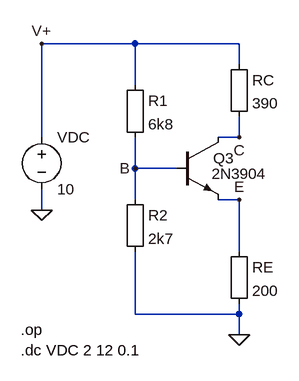
[diagram p0: schematic Transistorarbeitspunkt_Analyse.asc]
Transistorarbeitspunkt_Analyse.asc, the LTspice schematic file:
Version 4
SHEET 1 1160 680
WIRE -736 -160 -880 -160
WIRE -576 -160 -736 -160
WIRE -576 -128 -576 -160
WIRE -736 -96 -736 -160
WIRE -880 -16 -880 -160
WIRE -576 -16 -576 -48
WIRE -576 -16 -608 -16
WIRE -736 32 -736 -16
WIRE -672 32 -736 32
WIRE -736 80 -736 32
WIRE -576 80 -608 80
WIRE -880 96 -880 64
WIRE -576 160 -576 80
WIRE -736 256 -736 160
WIRE -576 256 -576 240
WIRE -576 256 -736 256
WIRE -576 288 -576 256
FLAG -880 96 0
FLAG -576 288 0
FLAG -880 -160 V+
FLAG -736 32 B
FLAG -576 -16 C
FLAG -576 80 E
SYMBOL EuropeanResistor -592 144 R0
SYMATTR InstName RE
SYMATTR Value 200
SYMBOL EuropeanResistor -592 -144 R0
SYMATTR InstName RC
SYMATTR Value 390
SYMBOL EuropeanResistor -752 -112 R0
SYMATTR InstName R1
SYMATTR Value 6k8
SYMBOL EuropeanResistor -752 64 R0
SYMATTR InstName R2
SYMATTR Value 2k7
SYMBOL npn -672 -16 R0
WINDOW 3 54 56 Left 2
SYMATTR Value 2N3904
SYMATTR InstName Q3
SYMBOL voltage -880 -32 R0
WINDOW 123 0 0 Left 2
WINDOW 39 0 0 Left 2
SYMATTR InstName VDC
SYMATTR Value 10
TEXT -912 312 Left 2 !.dc VDC 2 12 0.1
TEXT -912 280 Left 2 !.op

The netlist it stands for:
* Transistorarbeitspunkt_Analyse.asc
RE E 0 200
RC V+ C 390
R1 V+ B 6k8
R2 B 0 2k7
Q3 C B E 0 2N3904
VDC V+ 0 10
.model NPN NPN
.model PNP PNP
.lib standard.bjt
.dc VDC 2 12 0.1
.op
.backanno
.end